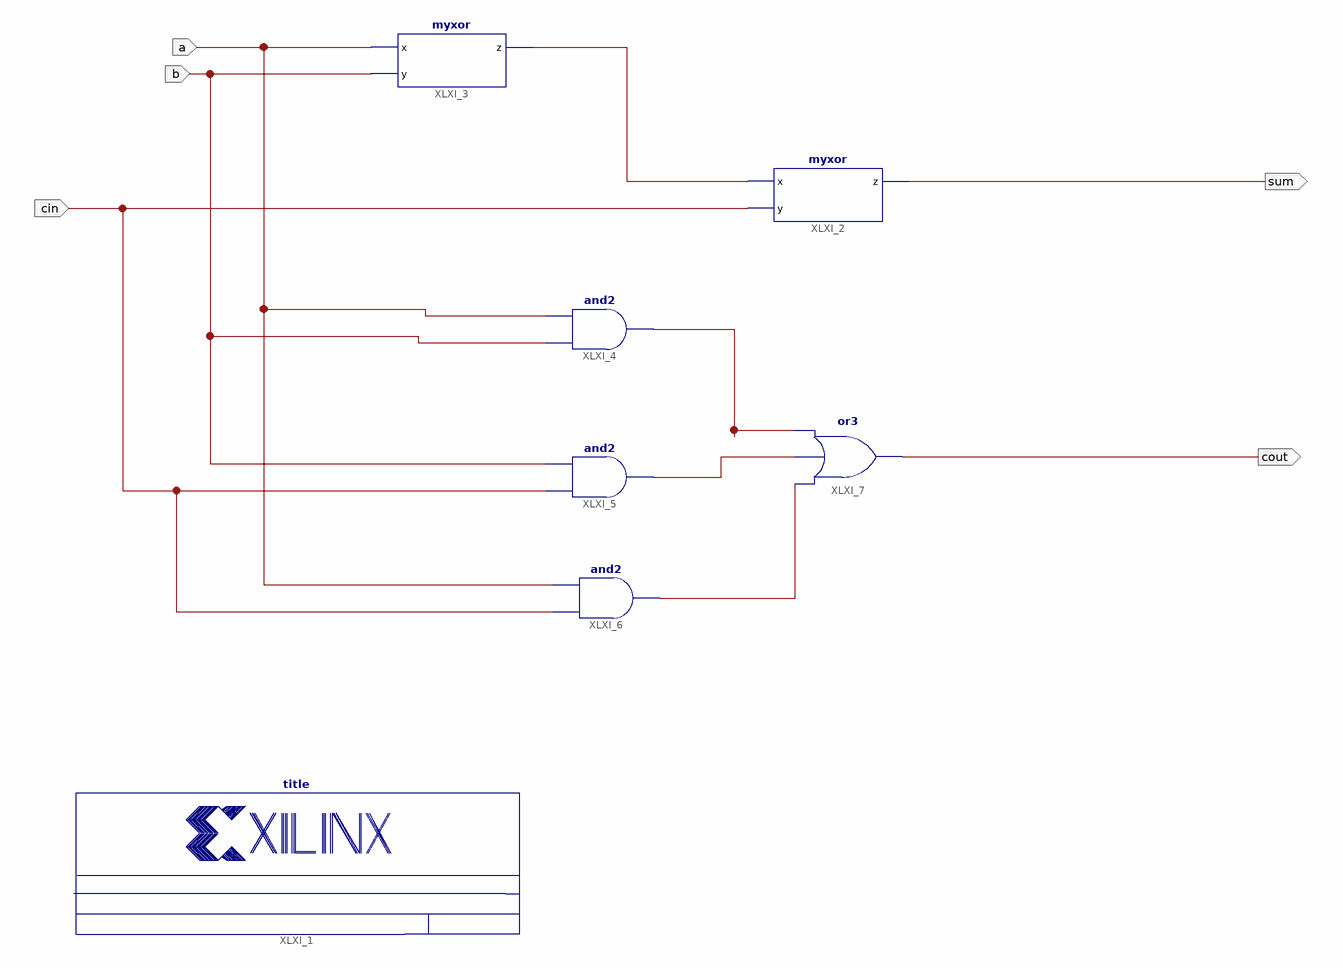
[diagram p0: schematic sheet 1]
// Xilinx ISE schematic fuller_adder_sch.sch (spartan3e) as structural Verilog: 7 symbols, 5 ports
module fuller_adder_sch (
  input  a,
  input  b,
  input  cin,
  output sum,
  output cout
);

  wire XLXN_2, XLXN_4, XLXN_5, XLXN_6;

  title #(.NameFieldText("Full Adder")) XLXI_1 ();
  myxor XLXI_2 (.x(XLXN_2), .y(cin), .z(sum));
  myxor XLXI_3 (.x(a), .y(b), .z(XLXN_2));
  and XLXI_4 (XLXN_4, b, a);
  and XLXI_5 (XLXN_5, cin, b);
  and XLXI_6 (XLXN_6, cin, a);
  or XLXI_7 (cout, XLXN_6, XLXN_5, XLXN_4);
endmodule
